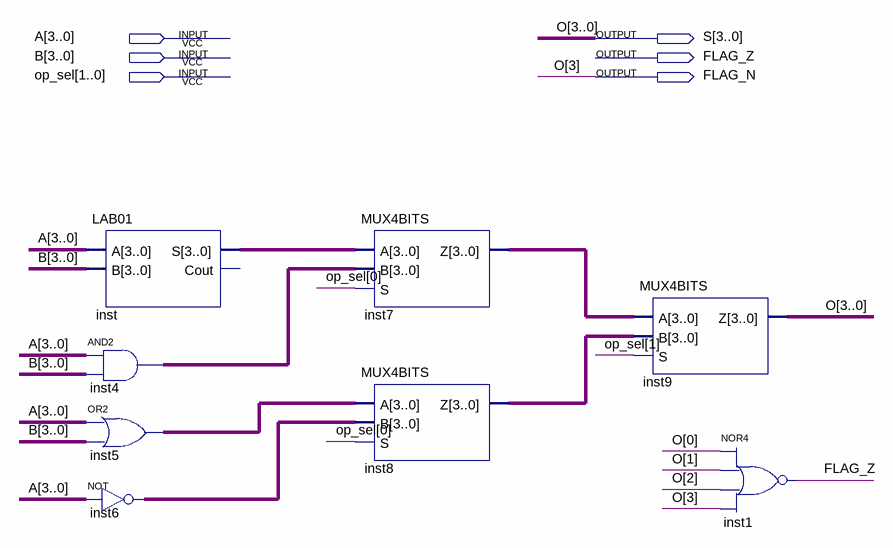
[diagram p0: schematic sheet]
// Quartus schematic ULA4bits.bdf as structural Verilog: 8 symbols, 6 pins
module ULA4bits (
  input  [3:0] A,
  input  [3:0] B,
  input  [1:0] op_sel,
  output [3:0] S,
  output FLAG_Z,
  output FLAG_N
);

  wire [3:0] inst4_out, inst5_out, inst6_out, inst7_z, inst8_z, inst_s;

  LAB01 inst (.A(A), .B(B), .S(inst_s));  // open: Cout
  assign inst4_out = A & B;  // AND2 inst4, 4 bits wide
  assign inst5_out = A | B;  // OR2 inst5, 4 bits wide
  assign inst6_out = ~A;  // NOT inst6, 4 bits wide
  MUX4BITS inst7 (.A(inst_s), .B(inst4_out), .S(op_sel[0]), .Z(inst7_z));
  MUX4BITS inst8 (.A(inst5_out), .B(inst6_out), .S(op_sel[0]), .Z(inst8_z));
  MUX4BITS inst9 (.A(inst7_z), .B(inst8_z), .S(op_sel[1]), .Z({FLAG_N, S[2:0]}));
  nor inst1 (FLAG_Z, S[0], S[1], S[2], FLAG_N);

  assign S[3] = FLAG_N;

  // Other names for the same wires on the sheet: O[3:0] = {FLAG_N, S[2:0]}
endmodule
